# EasyEDA schematic SCH_max7456v1_2025-06-15.json
TITLE: MAX7456; REV: 1.0; Date: 2025-06-15; Sheet: 1/1; Drawn By: Serhii Iziumenko
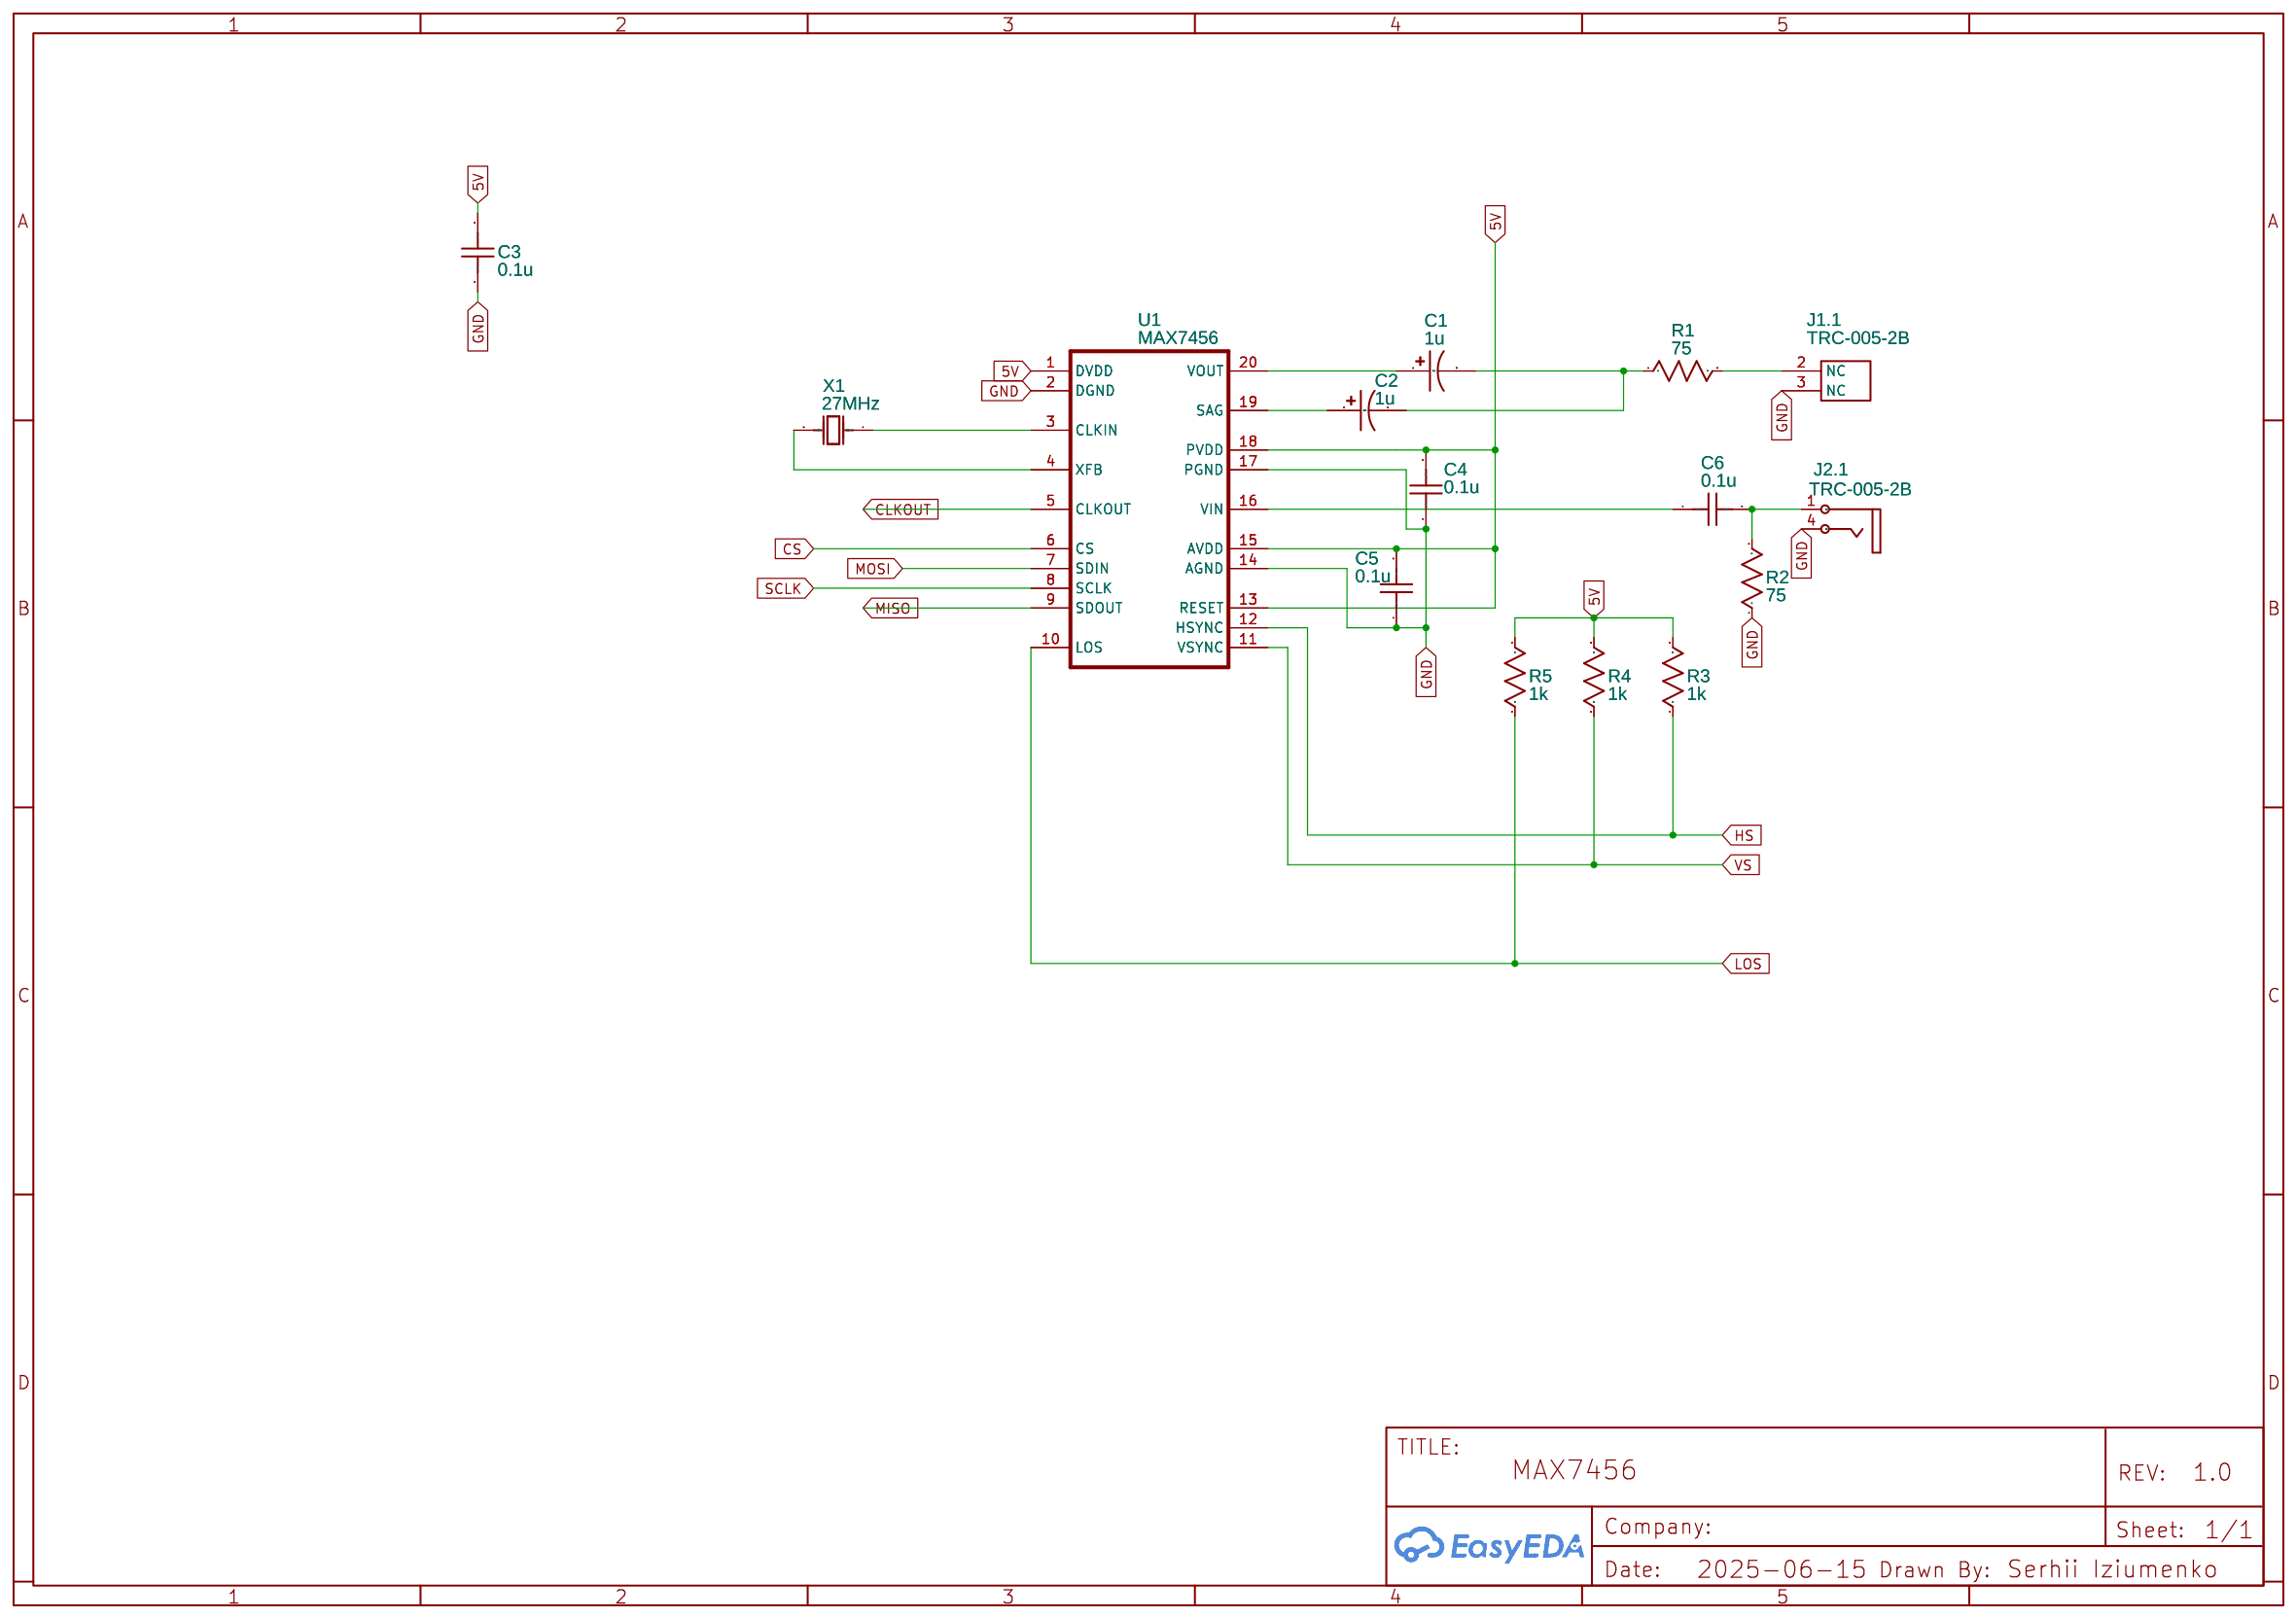
[diagram p0: schematic sheet]

## Parts
C1  1u  [CASE-A_3216]
C2  1u  [CASE-A_3216]
C3  0.1u  [C0603]
C4  0.1u  [C0603]
C5  0.1u  [C0603]
C6  0.1u  [C0603]
J1  TRC-005-2B  [TRC-005]  (section 1)
J2  TRC-005-2B  [TRC-005]  (section 1)
R1  75  [R0603]
R2  75  [R0603]
R3  1k  [R0603]
R4  1k  [R0603]
R5  1k  [R0603]
U1  MAX7456  [TSSOP28]
X1  27MHz  [CRYSTAL-SMD_2P-L5.0-W3.2]

## Library data of the parts
C1 C2 = C_Tan_SMD_A_US: Contributor: LCEDA_Lib
C3-C6 = C_0603_US: Contributor: LCEDA_Lib
J1 J2 = TRC-005-2B: RCA Phono Jack, Right Angle, Thru-Hole, Snap-In, 2-Conductor Open Circuit; subpart_no: 1
R1-R5 = R_0603_US: Contributor: LCEDA_Lib
U1 = MAX7456
X1 = XG1EL89CSI-111YLC-27M: Supplier: LCSC; Supplier Part: C18214301; Manufacturer: YXC(扬兴晶振); Contributor: lcsc; JLCPCB Part Class: Extended Part

## Nets
5V: C3.2 C4.2 C5.2 R3.2 R4.2 R5.2 U1.1(DVDD) U1.13(RESET) U1.15(AVDD) U1.18(PVDD)
GND: C3.1 C4.1 C5.1 J1.3(NC) J2.4(Red) R2.1 U1.2(DGND) U1.14(AGND) U1.17(PGND)
CLKOUT: U1.5(CLKOUT)
CS: U1.6(CS)
HS: R3.1 U1.12(HSYNC)
LOS: R5.1 U1.10(LOS)
MISO: U1.9(SDOUT)
MOSI: U1.7(SDIN)
SCLK: U1.8(SCLK)
VS: R4.1 U1.11(VSYNC)
Net-(C1-1): C1.1 U1.20(VOUT)
Net-(C1-2): C1.2 C2.2 R1.1
Net-(C2-1): C2.1 U1.19(SAG)
Net-(C6-1): C6.1 U1.16(VIN)
Net-(C6-2): C6.2 J2.1(Black) R2.2
Net-(J1.1-2): J1.2(NC) R1.2
Net-(U1-3): U1.3(CLKIN) X1.1(OSC1)
Net-(U1-4): U1.4(XFB) X1.2(OSC2)
